# Altium project External MSP-EXP430G2.PrjPcb
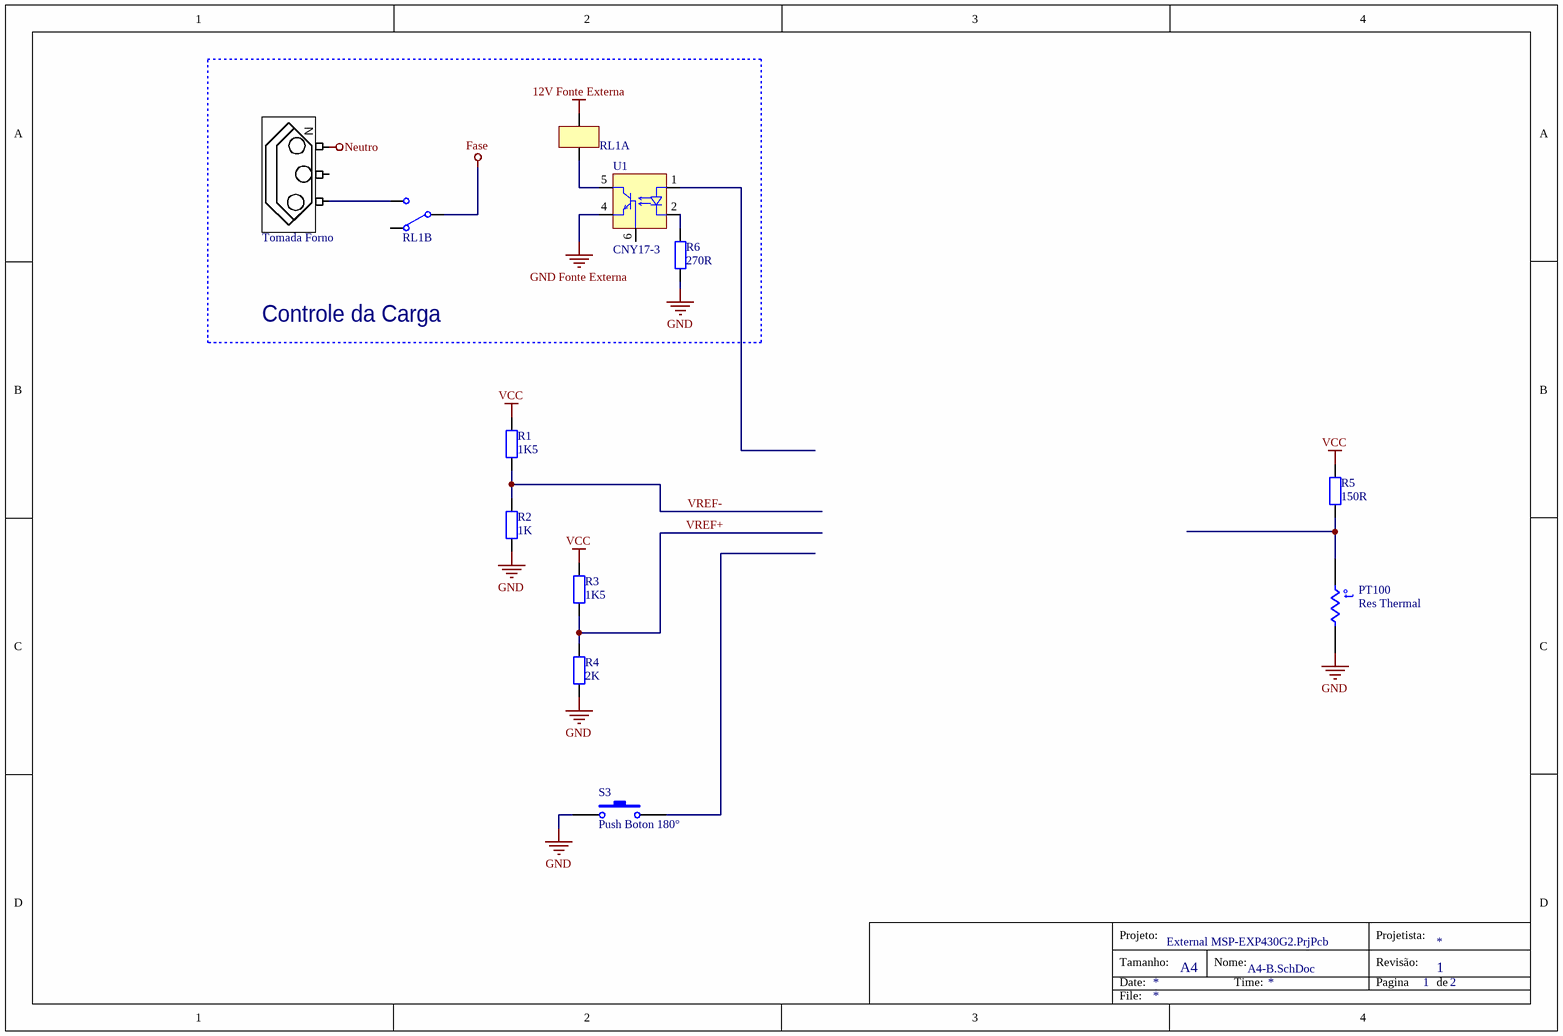
[diagram p0: A4-B.SchDoc]
1 sheet, 11 parts. Net scope: global (net labels, ports and power ports of the same name join across sheets).

## Sheet A4-B.SchDoc
size A4; Organization: Altium Limited; Address1: 3 Minna Close; Address2: Belrose; Address3: NSW 2085; Address4: Australia; Revision: 1; SheetNumber: 1; SheetTotal: 2; PageSetup: Record=PageOptions|CenterHorizontal=True|CenterVertical=True|PrintScale=0.97|XCorrection=1.00|YCorrection=1.00|PrintKind=0|BorderSize=5000000|LeftOffset=0|BottomOffset=0|Orientation=2|PaperLength=1000|PaperWidth=1000|Scale=100|PaperSource=7|PrintQuality=-3|MediaType=1|DitherType=10|PrintScaleMode=1|PaperKind=A4|PaperIndex=9

### Parts
PT100  Res Thermal  [6-0805_N]
R1  value 1K5  [Resistor 1/8]  (hidden comment: Res 1K5)
R2  value 1K  [Resistor 1/8]  (hidden comment: Res 1K)
R3  value 1K5  [Resistor 1/8]  (hidden comment: Res 1K5)
R4  value 2K  [Resistor 1/8]  (hidden comment: Res 2K)
R5  value 150R  [Resistor 1/8]  (hidden comment: Res 150R)
R6  value 270R  [Resistor 1/8]  (hidden comment: Res 270R)
RL1  RELE 1NA 1NF  [rele SRA]  (value not drawn)  (parts A,B of 2)
S3  Push Boton 180°  [PushButton - small - 2]
Tomada_Forno  TOMADA AC RETA  [EX-1401]  (value not drawn)  (mechanical)
U1  CNY17-3  [PDIP300-P6]

### Blocks framed on the sheet
Controle da Carga: R6 RL1 Tomada_Forno U1

### Nets
12V Fonte Externa: RL1.1(A1)
Fase: RL1.3(C)
GND: PT100.2 R2.1 R4.1 R6.1 S3.1
GND Fonte Externa: U1.4(E)
Neutro: Tomada_Forno.3(N)
VCC: R1.2 R3.2 R5.2
VREF+: R3.1 R4.2
VREF-: R1.1 R2.2
NetPT100_1: PT100.1 R5.1
NetR6_2: R6.2 U1.2(K)
NetRL1_2: RL1.2(A2) U1.5(C)
NetRL1_5: RL1.5(NA) Tomada_Forno.1(F)

Not connected (* = marked no-connect by the designer): RL1 4(NF); S3 2; Tomada_Forno 2(T); U1 1(A) 6(B)

### Notes on the sheet
- Projeto:
- Tamanho:
- Date:
- A4
- Nome:
- Time:
- Pagina
- Projetista:
- Revisão:
- de
- File:
- (in symbol Res Thermal) t°

### Library data of the parts
PT100 = Res Thermal: Thermistor; Published: 24-Mar-1999; LatestRevisionDate: 29-May-2009; LatestRevisionNote: IPC-7351 Footprint Added.; PackageVersion: Mar-2003; PackageReference: 6-0805; Publisher: Altium Limited; PackageDescription: Chip Resistor 0805 Case Size; Code_IPC: RESC2012
R1 R3 = Res 1K5: Resistor; Almox.Gaia: RESISTOR    1K5; Código: 000699; Published: 8-Jun-2000; LatestRevisionDate: 22-Mar-2011; LatestRevisionNote: Re-released for DXP Platform.; PackageReference: AXIAL-0.4; Publisher: Altium Limited
R2 = Res 1K: Resistor; Almox.Gaia: RESISTOR    1K; Código: 000698; Published: 8-Jun-2000; LatestRevisionDate: 22-Mar-2011; LatestRevisionNote: Re-released for DXP Platform.; PackageReference: AXIAL-0.4; Publisher: Altium Limited
R4 = Res 2K2: Resistor; Almox.Gaia: RESISTOR    2K; Código: 000700; Published: 8-Jun-2000; LatestRevisionDate: 22-Mar-2011; LatestRevisionNote: Re-released for DXP Platform.; PackageReference: AXIAL-0.4; Publisher: Altium Limited
R5 = Res 180R: Resistor; Almox.Gaia: RESISTOR 150R; Código: 000714; Published: 8-Jun-2000; LatestRevisionDate: 22-Mar-2011; LatestRevisionNote: Re-released for DXP Platform.; PackageReference: AXIAL-0.4; Publisher: Altium Limited
R6 = Res 270R: Resistor; Almox.Gaia: RESISTOR 270R; Código: 000716; Published: 8-Jun-2000; LatestRevisionDate: 22-Mar-2011; LatestRevisionNote: Re-released for DXP Platform.; PackageReference: AXIAL-0.4; Publisher: Altium Limited
RL1 = RELE 1NA 1NF: Relay; Manufacturer: Metaltex; Class I: Electro-mechanical; Almox.Gaia: RELE SRA 12V DC; Código: 000697; Class II: Relay; Published: 23-may-2004; Publisher: Gaia Component
S3 = Push Boton 180°: Switch; Almox.Gaia: CHAVE TACTIL 3,4 x 6 x 2,5 180°; Código: 7325; Published: 24-Mar-1999; LatestRevisionDate: 25-out-2011; LatestRevisionNote: Re-released for DXP Platform.; PackageReference: SPST-2; Publisher: Altium Limited
Tomada_Forno = TOMADA AC RETA: TOMADA AC; Almox.Gaia: TOMADA DE FORÇA RETA 1401PT; Código: 003628; LatestRevisionDate: 22-Mar-2011; LatestRevisionNote: Re-released for DXP Platform.; Publisher: Altium Limited
U1 = CNY17-3: Optocoupler, Phototransistor Output, Dual Channel, TTL Compatible, Pb-free; Note: Coupling Capacitance, 0.5 pF; Note: Transfer Ratio, 35 % Typical; Almox.Gaia: CI CNY 17-3; Código: 000463; Published: 6-Oct-2005; DatasheetDocument: Rev. 1.4, Oct-2004; PackageDocument: Dec-2003; PackageReference: DIP6; Publisher: Altium Limited; ComponentLink1Description: Manufacturer Link; ComponentLink1URL: http://www.vishay.com/optocouplers/list/product-83640/; ComponentLink2Description: Datasheet; ComponentLink2URL: http://www.vishay.com/docs/83640/83640.pdf